# Altium project DoanVXL_PCB.PrjPcb
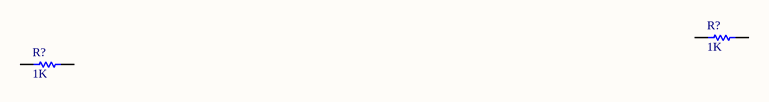
[diagram p0: Sheet1.SchDoc]
1 sheet, 2 parts. Net scope: global (net labels, ports and power ports of the same name join across sheets).
Board file: PCB1.PcbDoc

## Sheet Sheet1.SchDoc
size A; SheetNumber: 1; SheetTotal: 1

### Parts
(Parts that share a designator on the sheet are numbered #1, #2 ... from top to bottom, then left to right.)
R?#1  value 1K  (hidden comment: Resistor)
R?#2  value 1K  (hidden comment: Resistor)

### Nets

Not connected (* = marked no-connect by the designer): R?#1 1 2; R?#2 1 2

### Library data of the parts
R?#1 R?#2 = Resistor: TC1: 0; SimulationGenericComponent: True; TC2: 0